# Altium project PROC154E3_SCH.PrjPcb (part 29 of 60)

## Sheet 31. USB HUB.SchDoc: USB3.0 HUB
size 513 x 386 mm; Project: PROC154E2(001)_SK_AM69; Issue: 1.0; RevCode: E3; Page Create Date: March  8, 1995; Variant Name: Core Design; Schematic Page Number: 31; Page Number: 31; Page Size: C; Comment: MISTRAL_TITLEBLK_CSIZE_1; Page Count: 62; Schematic Page Count: 62; Name: PROC154E2 001 SK AM69; DsnPath: C:\Users\danie\Downloads\sprr466c\PROC154E3_RP\PROC154E3_SCH.DSN; SchematicName: SCHEMATIC1; PageName: 31. USB HUB; PageSize: C; TopSchematic: True
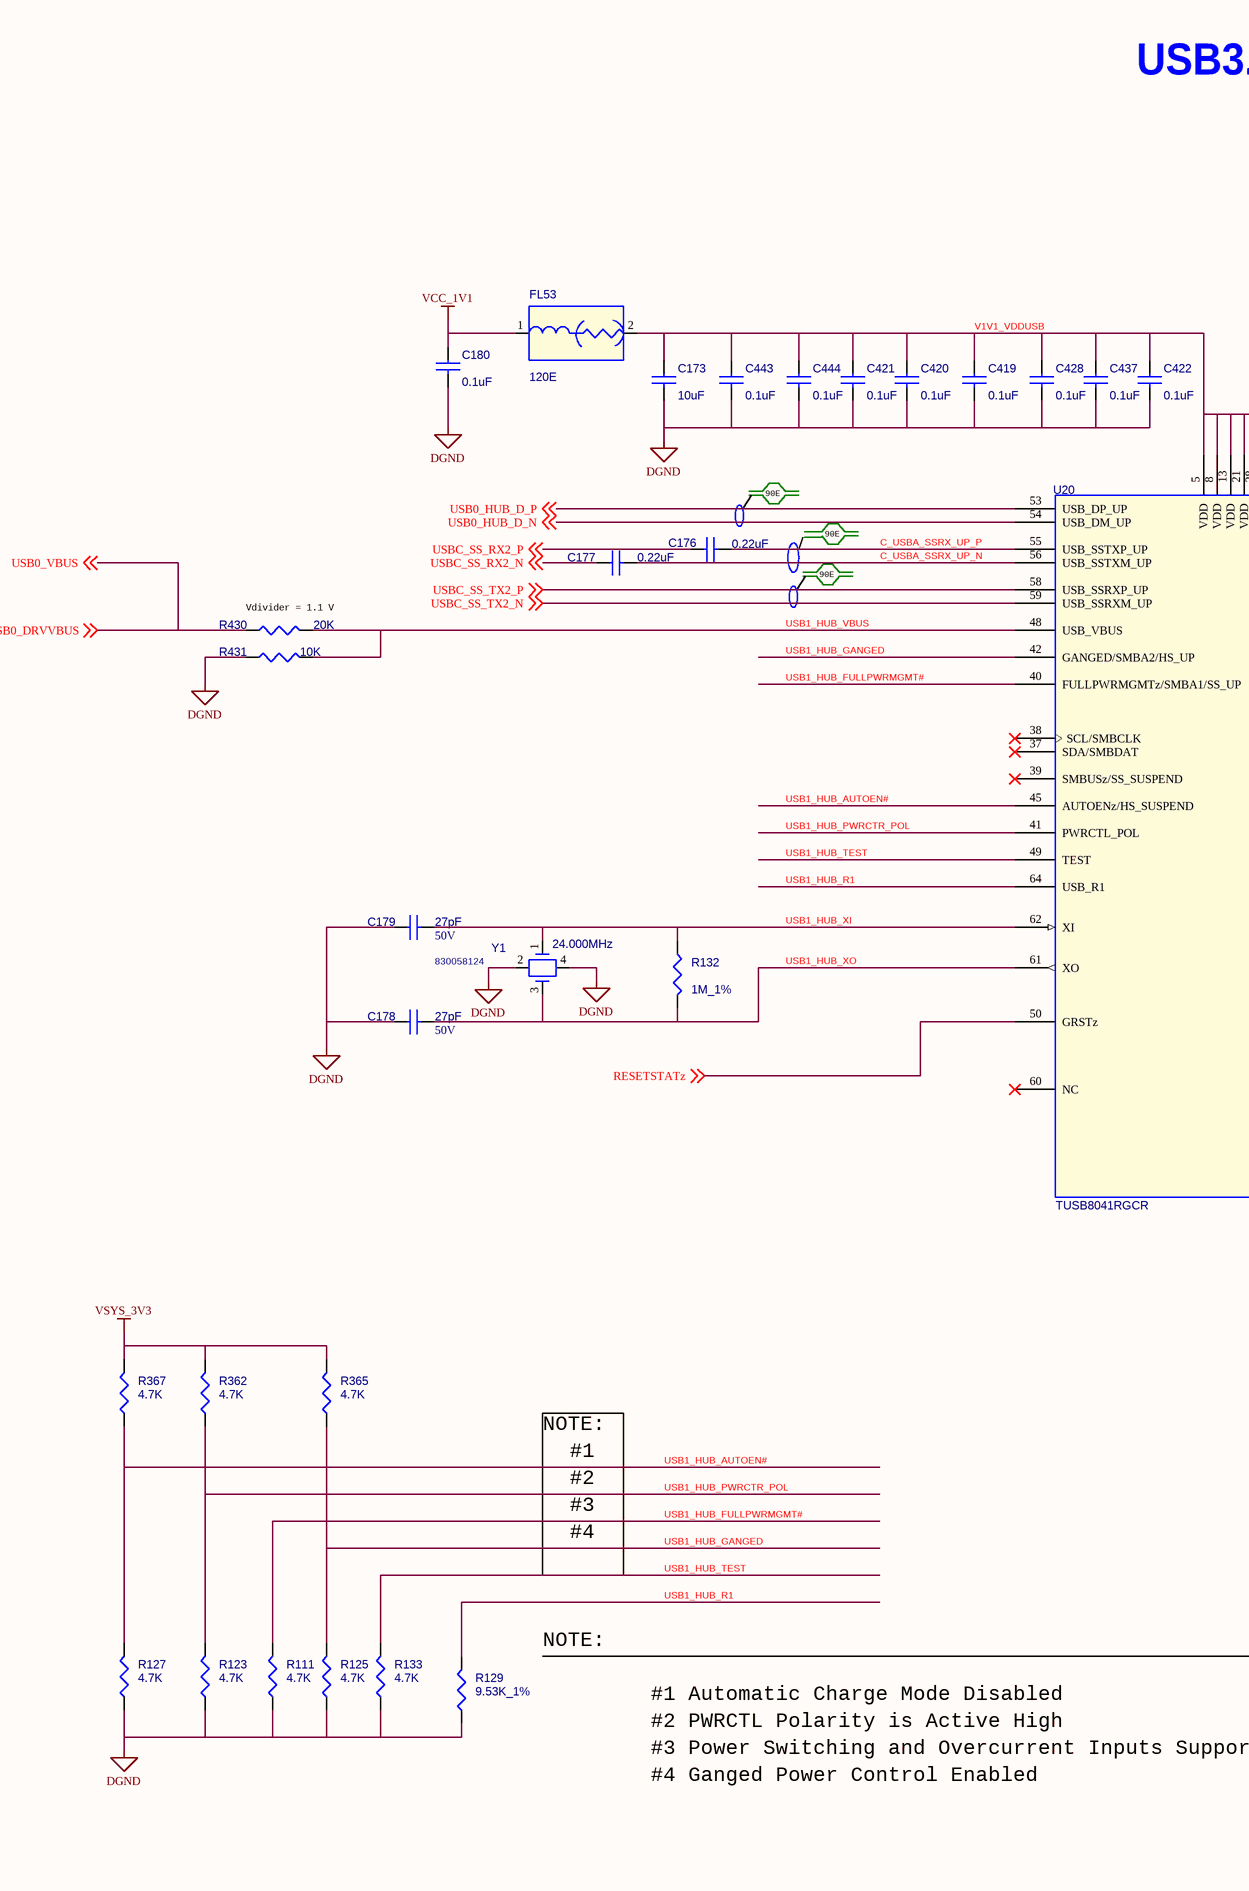
[diagram p49: 31. USB HUB.SchDoc, left]
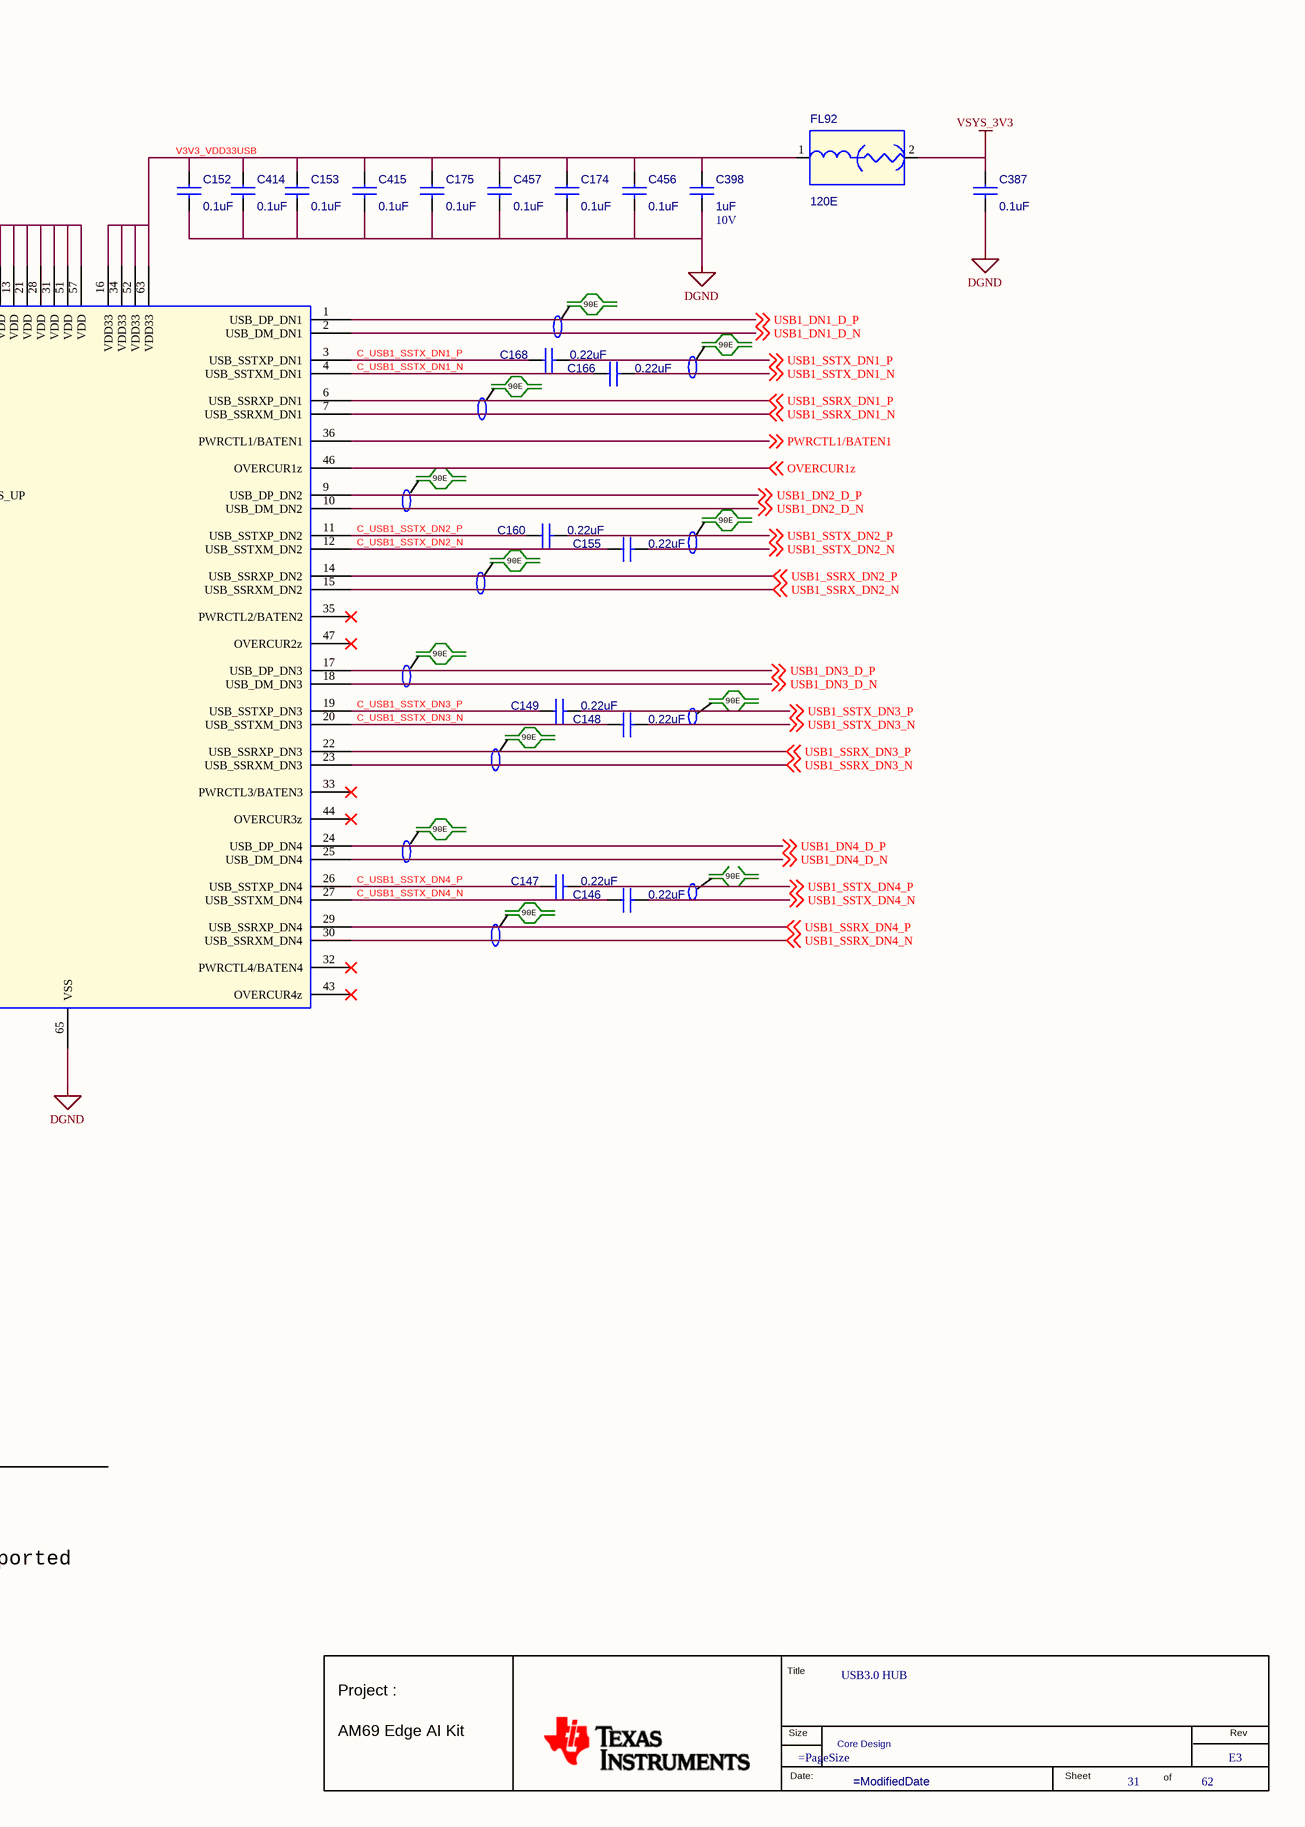
[diagram p50: 31. USB HUB.SchDoc, right]

### Parts
(Parts that share a designator on the sheet are numbered #1, #2 ... from top to bottom, then left to right.)
*#31  RevCode: E3  Title: USB3.0 HUB  Page Number: 31  Page Count: 62  Variant Name: Core Design  (hidden comment: MISTRAL_TITLEBLK_CSIZE_1)  (graphical)
C146  0.22uF  [CAP0201_0-5]
C147  0.22uF  [CAP0201_0-5]
C148  0.22uF  [CAP0201_0-5]
C149  0.22uF  [CAP0201_0-5]
C152  0.1uF  [CAP0201_0-5]
C153  0.1uF  [CAP0201_0-5]
C155  0.22uF  [CAP0201_0-5]
C160  0.22uF  [CAP0201_0-5]
C166  0.22uF  [CAP0201_0-5]
C168  0.22uF  [CAP0201_0-5]
C173  10uF  [CAP0402_1]
C174  0.1uF  [CAP0201_0-5]
C175  0.1uF  [CAP0201_0-5]
C176  0.22uF  [CAP0201_0-5]
C177  0.22uF  [CAP0201_0-5]
C178  27pF  Voltage: 50V  [CAP0402_0-75]
C179  27pF  Voltage: 50V  [CAP0402_0-75]
C180  0.1uF  [CAP0201_0-5]
C387  0.1uF  [CAP0201_0-5]
C398  1uF  Voltage: 10V  [CAP0402_0-75]
C414  0.1uF  [CAP0201_0-5]
C415  0.1uF  [CAP0201_0-5]
C419  0.1uF  [CAP0201_0-5]
C420  0.1uF  [CAP0201_0-5]
C421  0.1uF  [CAP0201_0-5]
C422  0.1uF  [CAP0201_0-5]
C428  0.1uF  [CAP0201_0-5]
C437  0.1uF  [CAP0201_0-5]
C443  0.1uF  [CAP0201_0-5]
C444  0.1uF  [CAP0201_0-5]
C456  0.1uF  [CAP0201_0-5]
C457  0.1uF  [CAP0201_0-5]
FL53  120E  [EMIFIL_BLM18P_0603_0-8]
FL92  120E  [EMIFIL_BLM18P_0603_0-8]
R111  4.7K  [RES0201_0-5]
R123  4.7K  [RES0201_0-5]
R125  4.7K  [RES0201_0-5]
R127  4.7K  [RES0201_0-5]
R129  9.53K_1%  [RES0402_0-5]
R132  1M_1%  [RES0402_0-5]
R133  4.7K  [RES0201_0-5]
R362  4.7K  [RES0201_0-5]
R365  4.7K  [RES0201_0-5]
R367  4.7K  [RES0201_0-5]
R430  20K  [RES0402_0-5]
R431  10K  [RES0402_0-5]
U20  TUSB8041RGCR  [QFN64_19-68_360X360_1_EP6-1]
Y1  24.000MHz  Mfr_part_number: 830058124  [XTAL4_LFXTAL055474_130X110_SMD_0-8]

### Nets
DGND: C152.2 C153.2 C173.2 C174.2 C175.2 C178.1 C179.1 C180.2 C387.2 C398.2 C414.2 C415.2 C419.2 C420.2 C421.2 C422.2 C428.2 C437.2 C443.2 C444.2 C456.2 C457.2 R111.1 R123.1 R125.1 R127.1 R129.1 R133.1 R431.1 U20.65(VSS) Y1.2 Y1.4  [project net VDD_CPU_HCPS_GOSNS]
VCC_1V1: C180.1 FL53.1
VSYS_3V3: C387.1 FL92.2 R362.2 R365.2 R367.2  [project net V_3V3]
C_USB1_SSTX_DN1_N: C166.1 U20.4(USB_SSTXM_DN1)
C_USB1_SSTX_DN1_P: C168.1 U20.3(USB_SSTXP_DN1)
C_USB1_SSTX_DN2_N: C155.1 U20.12(USB_SSTXM_DN2)
C_USB1_SSTX_DN2_P: C160.1 U20.11(USB_SSTXP_DN2)
C_USB1_SSTX_DN3_N: C148.1 U20.20(USB_SSTXM_DN3)
C_USB1_SSTX_DN3_P: C149.1 U20.19(USB_SSTXP_DN3)
C_USB1_SSTX_DN4_N: C146.1 U20.27(USB_SSTXM_DN4)
C_USB1_SSTX_DN4_P: C147.1 U20.26(USB_SSTXP_DN4)
C_USBA_SSRX_UP_N: C177.2 U20.56(USB_SSTXM_UP)
C_USBA_SSRX_UP_P: C176.2 U20.55(USB_SSTXP_UP)
OVERCUR1z: U20.46(OVERCUR1z) ; off-sheet OVERCUR1z
PWRCTL1/BATEN1: U20.36(PWRCTL1/BATEN1) ; off-sheet PWRCTL1/BATEN1
RESETSTATZ: U20.50(GRSTz) ; off-sheet RESETSTATz
USB0_DRVVBUS: R430.1 ; off-sheet USB0_DRVVBUS, off-sheet USB0_VBUS  [also labelled USB0_VBUS]  [project net TIMER_IO1]
USB0_HUB_D_N: U20.54(USB_DM_UP) ; off-sheet USB0_HUB_D_N
USB0_HUB_D_P: U20.53(USB_DP_UP) ; off-sheet USB0_HUB_D_P
USB1_DN1_D_N: U20.2(USB_DM_DN1) ; off-sheet USB1_DN1_D_N
USB1_DN1_D_P: U20.1(USB_DP_DN1) ; off-sheet USB1_DN1_D_P
USB1_DN2_D_N: U20.10(USB_DM_DN2) ; off-sheet USB1_DN2_D_N
USB1_DN2_D_P: U20.9(USB_DP_DN2) ; off-sheet USB1_DN2_D_P
USB1_DN3_D_N: U20.18(USB_DM_DN3) ; off-sheet USB1_DN3_D_N
USB1_DN3_D_P: U20.17(USB_DP_DN3) ; off-sheet USB1_DN3_D_P
USB1_DN4_D_N: U20.25(USB_DM_DN4) ; off-sheet USB1_DN4_D_N
USB1_DN4_D_P: U20.24(USB_DP_DN4) ; off-sheet USB1_DN4_D_P
USB1_HUB_AUTOEN#: R127.2 R367.1 U20.45(AUTOENz/HS_SUSPEND)
USB1_HUB_FULLPWRMGMT#: R111.2 U20.40(FULLPWRMGMTz/SMBA1/SS_UP)
USB1_HUB_GANGED: R125.2 R365.1 U20.42(GANGED/SMBA2/HS_UP)
USB1_HUB_PWRCTR_POL: R123.2 R362.1 U20.41(PWRCTL_POL)
USB1_HUB_R1: R129.2 U20.64(USB_R1)
USB1_HUB_TEST: R133.2 U20.49(TEST)
USB1_HUB_VBUS: R430.2 R431.2 U20.48(USB_VBUS)
USB1_HUB_XI: C179.2 R132.1 U20.62(XI) Y1.1
USB1_HUB_XO: C178.2 R132.2 U20.61(XO) Y1.3
USB1_SSRX_DN1_N: U20.7(USB_SSRXM_DN1) ; off-sheet USB1_SSRX_DN1_N
USB1_SSRX_DN1_P: U20.6(USB_SSRXP_DN1) ; off-sheet USB1_SSRX_DN1_P
USB1_SSRX_DN2_N: U20.15(USB_SSRXM_DN2) ; off-sheet USB1_SSRX_DN2_N
USB1_SSRX_DN2_P: U20.14(USB_SSRXP_DN2) ; off-sheet USB1_SSRX_DN2_P
USB1_SSRX_DN3_N: U20.23(USB_SSRXM_DN3) ; off-sheet USB1_SSRX_DN3_N
USB1_SSRX_DN3_P: U20.22(USB_SSRXP_DN3) ; off-sheet USB1_SSRX_DN3_P
USB1_SSRX_DN4_N: U20.30(USB_SSRXM_DN4) ; off-sheet USB1_SSRX_DN4_N
USB1_SSRX_DN4_P: U20.29(USB_SSRXP_DN4) ; off-sheet USB1_SSRX_DN4_P
USB1_SSTX_DN1_N: C166.2 ; off-sheet USB1_SSTX_DN1_N
USB1_SSTX_DN1_P: C168.2 ; off-sheet USB1_SSTX_DN1_P
USB1_SSTX_DN2_N: C155.2 ; off-sheet USB1_SSTX_DN2_N
USB1_SSTX_DN2_P: C160.2 ; off-sheet USB1_SSTX_DN2_P
USB1_SSTX_DN3_N: C148.2 ; off-sheet USB1_SSTX_DN3_N
USB1_SSTX_DN3_P: C149.2 ; off-sheet USB1_SSTX_DN3_P
USB1_SSTX_DN4_N: C146.2 ; off-sheet USB1_SSTX_DN4_N
USB1_SSTX_DN4_P: C147.2 ; off-sheet USB1_SSTX_DN4_P
USBC_SS_RX2_N: C177.1 ; off-sheet USBC_SS_RX2_N  [project net SERDES0_RX3_N]
USBC_SS_RX2_P: C176.1 ; off-sheet USBC_SS_RX2_P  [project net SERDES0_RX3_P]
USBC_SS_TX2_N: U20.59(USB_SSRXM_UP) ; off-sheet USBC_SS_TX2_N
USBC_SS_TX2_P: U20.58(USB_SSRXP_UP) ; off-sheet USBC_SS_TX2_P
V1V1_VDDUSB: C173.1 C419.1 C420.1 C421.1 C422.1 C428.1 C437.1 C443.1 C444.1 FL53.2 U20.5(VDD) U20.8(VDD) U20.13(VDD) U20.21(VDD) U20.28(VDD) U20.31(VDD) U20.51(VDD) U20.57(VDD)
V3V3_VDD33USB: C152.1 C153.1 C174.1 C175.1 C398.1 C414.1 C415.1 C456.1 C457.1 FL92.1 U20.16(VDD33) U20.34(VDD33) U20.52(VDD33) U20.63(VDD33)

Not connected (* = marked no-connect by the designer): U20 32(PWRCTL4/BATEN4)* 33(PWRCTL3/BATEN3)* 35(PWRCTL2/BATEN2)* 37(SDA/SMBDAT)* 38(SCL/SMBCLK)* 39(SMBUSz/SS_SUSPEND)* 43(OVERCUR4z)* 44(OVERCUR3z)* 47(OVERCUR2z)* 60(NC)*

### Notes on the sheet
- USB3.0 HUB
- 90E
- (near C168) 90E
- (near R430) Vdivider = 1.1 V
- (near C160) 90E
- (near C149) 90E
- (near C147) 90E
- NOTE:
- #1
- #2
- #3
- #4
- #1 Automatic Charge Mode Disabled
- #2 PWRCTL Polarity is Active High
- #3 Power Switching and Overcurrent Inputs Supported
- #4 Ganged Power Control Enabled
- (in symbol MISTRAL_TITLEBLK_CSIZE_1) Title; Project :; Size; Rev; AM69 Edge AI Kit; Date:; Sheet; of

### Library data of the parts
*#31 = MISTRAL_TITLEBLK_CSIZE_1: Issue: 1.0; Project: PROC154E2(001)_SK_AM69; Name: PROC154E2 001 SK AM69; Page Create Date: March  8, 1995; Page Size: =PageSize; Page Modify Date: =ModifiedDate; Schematic Page Count: 62; Schematic Page Number: 31
C146 = CAP_Dup1: CAP CERAMIC 0.22uF 6.3V 10% X6S AUTO 0201; Part Reference: C146; Part_type: CAPACITORS\CERAMIC; Mfr_part_number: GRT033C80J224KE01D; Mfr_name: MURATA; Mistral Part No: 120019020011-R; Custom_Duty: 15%; Customs_HS_Code: 85322990; Wattage: NA; Project: TI_J7ES_EVM_SOM; SIGNAL_MODEL: CAP_CAP0201_0-5_0.22UF_0.22uF; Value: 0.22uF; PCB Footprint: CAP0201_0-5; Footprint Path: Y:\MIS_DATABASE\Library\ALTIUM_TOOL\PCB_FOOTPRINTS\Altium_Footprint_Lib.PcbLib; Library Path: Y:\MIS_DATABASE\Library\ALTIUM_TOOL\SCHEMATICS_PARTS\MS_DISCRETE_Library.schlib; MECHANICAL 3D STEP FILE: CAP0201_0-5; Chkd/date: MANIRAJA/220219; Crtd /date: ALVY/220219; Datasheet: Y:\MIS_DATABASE\DATASHEETS\CAPACITORS\MURATA-GCM-SER.PDF; Temperature: -55°C+105°C; Weight: 0.17mg; Height: 0.33MM; Library Ref: CAP; Distributor_part_number: 490-12230-1-ND; Distributor_name: DIGIKEY; Package: 0201; Voltage: 6.3V; Tolerance: 10%; Footprint Ref: CAP0201_0-5
C147 = CAP_Dup1: CAP CERAMIC 0.22uF 6.3V 10% X6S AUTO 0201; Part Reference: C147; Mistral Part No: 120019020011-R; Mfr_name: MURATA; Mfr_part_number: GRT033C80J224KE01D; Part_type: CAPACITORS\CERAMIC; Project: TI_J7ES_EVM_SOM; Wattage: NA; Customs_HS_Code: 85322990; Custom_Duty: 15%; SIGNAL_MODEL: CAP_CAP0201_0-5_0.22UF_0.22uF; Value: 0.22uF; PCB Footprint: CAP0201_0-5; Footprint Ref: CAP0201_0-5; Tolerance: 10%; Voltage: 6.3V; Package: 0201; Distributor_name: DIGIKEY; Distributor_part_number: 490-12230-1-ND; Library Ref: CAP; Height: 0.33MM; Weight: 0.17mg; Temperature: -55°C+105°C; Datasheet: Y:\MIS_DATABASE\DATASHEETS\CAPACITORS\MURATA-GCM-SER.PDF; Crtd /date: ALVY/220219; Chkd/date: MANIRAJA/220219; MECHANICAL 3D STEP FILE: CAP0201_0-5; Library Path: Y:\MIS_DATABASE\Library\ALTIUM_TOOL\SCHEMATICS_PARTS\MS_DISCRETE_Library.schlib; Footprint Path: Y:\MIS_DATABASE\Library\ALTIUM_TOOL\PCB_FOOTPRINTS\Altium_Footprint_Lib.PcbLib
C148 = CAP_Dup1: CAP CERAMIC 0.22uF 6.3V 10% X6S AUTO 0201; Part Reference: C148; Mistral Part No: 120019020011-R; Mfr_name: MURATA; Mfr_part_number: GRT033C80J224KE01D; Part_type: CAPACITORS\CERAMIC; Project: TI_J7ES_EVM_SOM; Wattage: NA; Customs_HS_Code: 85322990; Custom_Duty: 15%; SIGNAL_MODEL: CAP_CAP0201_0-5_0.22UF_0.22uF; Value: 0.22uF; PCB Footprint: CAP0201_0-5; Footprint Ref: CAP0201_0-5; Tolerance: 10%; Voltage: 6.3V; Package: 0201; Distributor_name: DIGIKEY; Distributor_part_number: 490-12230-1-ND; Library Ref: CAP; Height: 0.33MM; Weight: 0.17mg; Temperature: -55°C+105°C; Datasheet: Y:\MIS_DATABASE\DATASHEETS\CAPACITORS\MURATA-GCM-SER.PDF; Crtd /date: ALVY/220219; Chkd/date: MANIRAJA/220219; MECHANICAL 3D STEP FILE: CAP0201_0-5; Library Path: Y:\MIS_DATABASE\Library\ALTIUM_TOOL\SCHEMATICS_PARTS\MS_DISCRETE_Library.schlib; Footprint Path: Y:\MIS_DATABASE\Library\ALTIUM_TOOL\PCB_FOOTPRINTS\Altium_Footprint_Lib.PcbLib
C149 = CAP_Dup1: CAP CERAMIC 0.22uF 6.3V 10% X6S AUTO 0201; Part Reference: C149; Part_type: CAPACITORS\CERAMIC; Mfr_part_number: GRT033C80J224KE01D; Mfr_name: MURATA; Mistral Part No: 120019020011-R; Custom_Duty: 15%; Customs_HS_Code: 85322990; Wattage: NA; Project: TI_J7ES_EVM_SOM; SIGNAL_MODEL: CAP_CAP0201_0-5_0.22UF_0.22uF; Value: 0.22uF; PCB Footprint: CAP0201_0-5; Footprint Path: Y:\MIS_DATABASE\Library\ALTIUM_TOOL\PCB_FOOTPRINTS\Altium_Footprint_Lib.PcbLib; Library Path: Y:\MIS_DATABASE\Library\ALTIUM_TOOL\SCHEMATICS_PARTS\MS_DISCRETE_Library.schlib; MECHANICAL 3D STEP FILE: CAP0201_0-5; Chkd/date: MANIRAJA/220219; Crtd /date: ALVY/220219; Datasheet: Y:\MIS_DATABASE\DATASHEETS\CAPACITORS\MURATA-GCM-SER.PDF; Temperature: -55°C+105°C; Weight: 0.17mg; Height: 0.33MM; Library Ref: CAP; Distributor_part_number: 490-12230-1-ND; Distributor_name: DIGIKEY; Package: 0201; Voltage: 6.3V; Tolerance: 10%; Footprint Ref: CAP0201_0-5
C152 = CAP_Dup1: CAP CERAMIC 0.1uF 16V 10% X7S AUTO 0201; Part Reference: C152; Mistral Part No: 120021030007-R; Mfr_name: MURATA; Mfr_part_number: GRT033C71C104KE01D; Part_type: CAPACITORS\CERAMIC; Project: J7ES_SK_BRD; Wattage: NA; Customs_HS_Code: 85322990; Custom_Duty: 15%; Value: 0.1uF; PCB Footprint: CAP0201_0-5; Tolerance: 10%; Voltage: 16V; Package: 0201; Distributor_name: DIGIKEY; Distributor_part_number: 490-GRT033C71C104KE01DTR-ND; Height: 0.33MM; Weight: 330mg; Temperature: -55°C+125°C; Datasheet: Y:\MIS_DATABASE\DATASHEETS\CAPACITORS\GRT033C71C104KE01.PDF; Crtd /date: ALVY/110321; Chkd/date: MANIRAJA/110321; MECHANICAL 3D STEP FILE: CAP0201_0-5
C153 = CAP_Dup1: CAP CERAMIC 0.1uF 16V 10% X7S AUTO 0201; Part Reference: C153; Mistral Part No: 120021030007-R; Mfr_name: MURATA; Mfr_part_number: GRT033C71C104KE01D; Part_type: CAPACITORS\CERAMIC; Project: J7ES_SK_BRD; Wattage: NA; Customs_HS_Code: 85322990; Custom_Duty: 15%; Value: 0.1uF; PCB Footprint: CAP0201_0-5; Tolerance: 10%; Voltage: 16V; Package: 0201; Distributor_name: DIGIKEY; Distributor_part_number: 490-GRT033C71C104KE01DTR-ND; Height: 0.33MM; Weight: 330mg; Temperature: -55°C+125°C; Datasheet: Y:\MIS_DATABASE\DATASHEETS\CAPACITORS\GRT033C71C104KE01.PDF; Crtd /date: ALVY/110321; Chkd/date: MANIRAJA/110321; MECHANICAL 3D STEP FILE: CAP0201_0-5
C155 = CAP_Dup1: CAP CERAMIC 0.22uF 6.3V 10% X6S AUTO 0201; Part Reference: C155; Mistral Part No: 120019020011-R; Mfr_name: MURATA; Mfr_part_number: GRT033C80J224KE01D; Part_type: CAPACITORS\CERAMIC; Project: TI_J7ES_EVM_SOM; Wattage: NA; Customs_HS_Code: 85322990; Custom_Duty: 15%; SIGNAL_MODEL: CAP_CAP0201_0-5_0.22UF_0.22uF; Value: 0.22uF; PCB Footprint: CAP0201_0-5; Footprint Ref: CAP0201_0-5; Tolerance: 10%; Voltage: 6.3V; Package: 0201; Distributor_name: DIGIKEY; Distributor_part_number: 490-12230-1-ND; Library Ref: CAP; Height: 0.33MM; Weight: 0.17mg; Temperature: -55°C+105°C; Datasheet: Y:\MIS_DATABASE\DATASHEETS\CAPACITORS\MURATA-GCM-SER.PDF; Crtd /date: ALVY/220219; Chkd/date: MANIRAJA/220219; MECHANICAL 3D STEP FILE: CAP0201_0-5; Library Path: Y:\MIS_DATABASE\Library\ALTIUM_TOOL\SCHEMATICS_PARTS\MS_DISCRETE_Library.schlib; Footprint Path: Y:\MIS_DATABASE\Library\ALTIUM_TOOL\PCB_FOOTPRINTS\Altium_Footprint_Lib.PcbLib
C160 = CAP_Dup1: CAP CERAMIC 0.22uF 6.3V 10% X6S AUTO 0201; Part Reference: C160; Mistral Part No: 120019020011-R; Mfr_name: MURATA; Mfr_part_number: GRT033C80J224KE01D; Part_type: CAPACITORS\CERAMIC; Project: TI_J7ES_EVM_SOM; Wattage: NA; Customs_HS_Code: 85322990; Custom_Duty: 15%; SIGNAL_MODEL: CAP_CAP0201_0-5_0.22UF_0.22uF; Value: 0.22uF; PCB Footprint: CAP0201_0-5; Footprint Ref: CAP0201_0-5; Tolerance: 10%; Voltage: 6.3V; Package: 0201; Distributor_name: DIGIKEY; Distributor_part_number: 490-12230-1-ND; Library Ref: CAP; Height: 0.33MM; Weight: 0.17mg; Temperature: -55°C+105°C; Datasheet: Y:\MIS_DATABASE\DATASHEETS\CAPACITORS\MURATA-GCM-SER.PDF; Crtd /date: ALVY/220219; Chkd/date: MANIRAJA/220219; MECHANICAL 3D STEP FILE: CAP0201_0-5; Library Path: Y:\MIS_DATABASE\Library\ALTIUM_TOOL\SCHEMATICS_PARTS\MS_DISCRETE_Library.schlib; Footprint Path: Y:\MIS_DATABASE\Library\ALTIUM_TOOL\PCB_FOOTPRINTS\Altium_Footprint_Lib.PcbLib
C166 = CAP_Dup1: CAP CERAMIC 0.22uF 6.3V 10% X6S AUTO 0201; Part Reference: C166; Part_type: CAPACITORS\CERAMIC; Mfr_part_number: GRT033C80J224KE01D; Mfr_name: MURATA; Mistral Part No: 120019020011-R; Custom_Duty: 15%; Customs_HS_Code: 85322990; Wattage: NA; Project: TI_J7ES_EVM_SOM; SIGNAL_MODEL: CAP_CAP0201_0-5_0.22UF_0.22uF; Value: 0.22uF; PCB Footprint: CAP0201_0-5; Footprint Path: Y:\MIS_DATABASE\Library\ALTIUM_TOOL\PCB_FOOTPRINTS\Altium_Footprint_Lib.PcbLib; Library Path: Y:\MIS_DATABASE\Library\ALTIUM_TOOL\SCHEMATICS_PARTS\MS_DISCRETE_Library.schlib; MECHANICAL 3D STEP FILE: CAP0201_0-5; Chkd/date: MANIRAJA/220219; Crtd /date: ALVY/220219; Datasheet: Y:\MIS_DATABASE\DATASHEETS\CAPACITORS\MURATA-GCM-SER.PDF; Temperature: -55°C+105°C; Weight: 0.17mg; Height: 0.33MM; Library Ref: CAP; Distributor_part_number: 490-12230-1-ND; Distributor_name: DIGIKEY; Package: 0201; Voltage: 6.3V; Tolerance: 10%; Footprint Ref: CAP0201_0-5
C168 = CAP_Dup1: CAP CERAMIC 0.22uF 6.3V 10% X6S AUTO 0201; Part Reference: C168; Part_type: CAPACITORS\CERAMIC; Mfr_part_number: GRT033C80J224KE01D; Mfr_name: MURATA; Mistral Part No: 120019020011-R; Custom_Duty: 15%; Customs_HS_Code: 85322990; Wattage: NA; Project: TI_J7ES_EVM_SOM; SIGNAL_MODEL: CAP_CAP0201_0-5_0.22UF_0.22uF; Value: 0.22uF; PCB Footprint: CAP0201_0-5; Footprint Path: Y:\MIS_DATABASE\Library\ALTIUM_TOOL\PCB_FOOTPRINTS\Altium_Footprint_Lib.PcbLib; Library Path: Y:\MIS_DATABASE\Library\ALTIUM_TOOL\SCHEMATICS_PARTS\MS_DISCRETE_Library.schlib; MECHANICAL 3D STEP FILE: CAP0201_0-5; Chkd/date: MANIRAJA/220219; Crtd /date: ALVY/220219; Datasheet: Y:\MIS_DATABASE\DATASHEETS\CAPACITORS\MURATA-GCM-SER.PDF; Temperature: -55°C+105°C; Weight: 0.17mg; Height: 0.33MM; Library Ref: CAP; Distributor_part_number: 490-12230-1-ND; Distributor_name: DIGIKEY; Package: 0201; Voltage: 6.3V; Tolerance: 10%; Footprint Ref: CAP0201_0-5
C173 = CAP_Dup1: CAP CERAMIC 10uF 10V 20% X5R 0402; Part Reference: C173; Mistral Part No: 120019020008-R; Mfr_name: SAMSUNG; Mfr_part_number: CL05A106MP8NUB8; Part_type: CAPACITORS\CERAMIC; Project: TI_60GHz-AOP; Wattage: NA; Customs_HS_Code: 85322990; Custom_Duty: 15%; Value: 10uF; PCB Footprint: CAP0402_1; Footprint Ref: CAP0402_1; Tolerance: 20%; Voltage: 10V; Package: 0402; Distributor_name: DIGIKEY; Distributor_part_number: 1276-6830-1-ND; Library Ref: CAP; Height: 0.90MM; Weight: NA; Temperature: -55°C+85°C; Datasheet: Y:\MIS_DATABASE\DATASHEETS\CAPACITORS\CL05A106MP8NUB8.PDF; Crtd /date: ALVY/150219; Chkd/date: MANIRAJA/150219; MECHANICAL 3D STEP FILE: CAP0402_1; Library Path: Y:\MIS_DATABASE\Library\ALTIUM_TOOL\SCHEMATICS_PARTS\MS_DISCRETE_Library.schlib; Footprint Path: Y:\MIS_DATABASE\Library\ALTIUM_TOOL\PCB_FOOTPRINTS\Altium_Footprint_Lib.PcbLib
C174 = CAP_Dup1: CAP CERAMIC 0.1uF 16V 10% X7S AUTO 0201; Part Reference: C174; Mistral Part No: 120021030007-R; Mfr_name: MURATA; Mfr_part_number: GRT033C71C104KE01D; Part_type: CAPACITORS\CERAMIC; Project: J7ES_SK_BRD; Wattage: NA; Customs_HS_Code: 85322990; Custom_Duty: 15%; Value: 0.1uF; PCB Footprint: CAP0201_0-5; Tolerance: 10%; Voltage: 16V; Package: 0201; Distributor_name: DIGIKEY; Distributor_part_number: 490-GRT033C71C104KE01DTR-ND; Height: 0.33MM; Weight: 330mg; Temperature: -55°C+125°C; Datasheet: Y:\MIS_DATABASE\DATASHEETS\CAPACITORS\GRT033C71C104KE01.PDF; Crtd /date: ALVY/110321; Chkd/date: MANIRAJA/110321; MECHANICAL 3D STEP FILE: CAP0201_0-5
C175 = CAP_Dup1: CAP CERAMIC 0.1uF 16V 10% X7S AUTO 0201; Part Reference: C175; Mistral Part No: 120021030007-R; Mfr_name: MURATA; Mfr_part_number: GRT033C71C104KE01D; Part_type: CAPACITORS\CERAMIC; Project: J7ES_SK_BRD; Wattage: NA; Customs_HS_Code: 85322990; Custom_Duty: 15%; Value: 0.1uF; PCB Footprint: CAP0201_0-5; Tolerance: 10%; Voltage: 16V; Package: 0201; Distributor_name: DIGIKEY; Distributor_part_number: 490-GRT033C71C104KE01DTR-ND; Height: 0.33MM; Weight: 330mg; Temperature: -55°C+125°C; Datasheet: Y:\MIS_DATABASE\DATASHEETS\CAPACITORS\GRT033C71C104KE01.PDF; Crtd /date: ALVY/110321; Chkd/date: MANIRAJA/110321; MECHANICAL 3D STEP FILE: CAP0201_0-5
C176 = CAP_Dup1: CAP CERAMIC 0.22uF 6.3V 10% X6S AUTO 0201; Part Reference: C176; Part_type: CAPACITORS\CERAMIC; Mfr_part_number: GRT033C80J224KE01D; Mfr_name: MURATA; Mistral Part No: 120019020011-R; Custom_Duty: 15%; Customs_HS_Code: 85322990; Wattage: NA; Project: TI_J7ES_EVM_SOM; SIGNAL_MODEL: CAP_CAP0201_0-5_0.22UF_0.22uF; Value: 0.22uF; PCB Footprint: CAP0201_0-5; Footprint Path: Y:\MIS_DATABASE\Library\ALTIUM_TOOL\PCB_FOOTPRINTS\Altium_Footprint_Lib.PcbLib; Library Path: Y:\MIS_DATABASE\Library\ALTIUM_TOOL\SCHEMATICS_PARTS\MS_DISCRETE_Library.schlib; MECHANICAL 3D STEP FILE: CAP0201_0-5; Chkd/date: MANIRAJA/220219; Crtd /date: ALVY/220219; Datasheet: Y:\MIS_DATABASE\DATASHEETS\CAPACITORS\MURATA-GCM-SER.PDF; Temperature: -55°C+105°C; Weight: 0.17mg; Height: 0.33MM; Library Ref: CAP; Distributor_part_number: 490-12230-1-ND; Distributor_name: DIGIKEY; Package: 0201; Voltage: 6.3V; Tolerance: 10%; Footprint Ref: CAP0201_0-5
C177 = CAP_Dup1: CAP CERAMIC 0.22uF 6.3V 10% X6S AUTO 0201; Part Reference: C177; Mistral Part No: 120019020011-R; Mfr_name: MURATA; Mfr_part_number: GRT033C80J224KE01D; Part_type: CAPACITORS\CERAMIC; Project: TI_J7ES_EVM_SOM; Wattage: NA; Customs_HS_Code: 85322990; Custom_Duty: 15%; SIGNAL_MODEL: CAP_CAP0201_0-5_0.22UF_0.22uF; Value: 0.22uF; PCB Footprint: CAP0201_0-5; Footprint Ref: CAP0201_0-5; Tolerance: 10%; Voltage: 6.3V; Package: 0201; Distributor_name: DIGIKEY; Distributor_part_number: 490-12230-1-ND; Library Ref: CAP; Height: 0.33MM; Weight: 0.17mg; Temperature: -55°C+105°C; Datasheet: Y:\MIS_DATABASE\DATASHEETS\CAPACITORS\MURATA-GCM-SER.PDF; Crtd /date: ALVY/220219; Chkd/date: MANIRAJA/220219; MECHANICAL 3D STEP FILE: CAP0201_0-5; Library Path: Y:\MIS_DATABASE\Library\ALTIUM_TOOL\SCHEMATICS_PARTS\MS_DISCRETE_Library.schlib; Footprint Path: Y:\MIS_DATABASE\Library\ALTIUM_TOOL\PCB_FOOTPRINTS\Altium_Footprint_Lib.PcbLib
C178 = CAP_Dup1: CAP CERAMIC 27pF 50V 5% C0G(NP0) AUTO 0402; Part Reference: C178; Automotive Alternate_mfr_part_number: CGA2B2C0G1H270J050BA; Automotive Alternate_mfr_name: TDK; Direct Alternate_mfr_part_number: CL05C270JB5NNNC; Direct Alternate_mfr_name: SAMSUNG; Mistral Part No: 120019040040-R; Mfr_name: MURATA; Mfr_part_number: GCM1555C1H270JA16D; Part_type: CAPACITORS\CERAMIC; Wattage: NA; Project: RSAPR_TYPE-II_DIO; Customs_HS_Code: 85322990; Custom_Duty: 15%; Value: 27pF; PCB Footprint: CAP0402_0-75; Footprint Path: Y:\MIS_DATABASE\Library\ALTIUM_TOOL\PCB_FOOTPRINTS\Altium_Footprint_Lib.PcbLib; Library Path: Y:\MIS_DATABASE\Library\ALTIUM_TOOL\SCHEMATICS_PARTS\MS_DISCRETE_Library.schlib; MECHANICAL 3D STEP FILE: CAP0402_0-75; Temperature: -55°C+125°C; Weight: 6mg; Footprint Ref: CAP0402_0-75; Tolerance: 5%; Package: 0402; Distributor_name: DIGIKEY; Distributor_part_number: 490-12651-1-ND; Library Ref: CAP; Height: 0.55MM; Datasheet: Y:\MIS_DATABASE\DATASHEETS\CAPACITORS\MURATA-GCM-SER.PDF; Crtd /date: ALVY/260218; Chkd/date: MANIRAJA/270218
C179 = CAP_Dup1: CAP CERAMIC 27pF 50V 5% C0G(NP0) AUTO 0402; Part Reference: C179; Automotive Alternate_mfr_part_number: CGA2B2C0G1H270J050BA; Automotive Alternate_mfr_name: TDK; Direct Alternate_mfr_part_number: CL05C270JB5NNNC; Direct Alternate_mfr_name: SAMSUNG; Mistral Part No: 120019040040-R; Mfr_name: MURATA; Mfr_part_number: GCM1555C1H270JA16D; Part_type: CAPACITORS\CERAMIC; Wattage: NA; Project: RSAPR_TYPE-II_DIO; Customs_HS_Code: 85322990; Custom_Duty: 15%; Value: 27pF; PCB Footprint: CAP0402_0-75; Footprint Path: Y:\MIS_DATABASE\Library\ALTIUM_TOOL\PCB_FOOTPRINTS\Altium_Footprint_Lib.PcbLib; Library Path: Y:\MIS_DATABASE\Library\ALTIUM_TOOL\SCHEMATICS_PARTS\MS_DISCRETE_Library.schlib; MECHANICAL 3D STEP FILE: CAP0402_0-75; Temperature: -55°C+125°C; Weight: 6mg; Footprint Ref: CAP0402_0-75; Tolerance: 5%; Package: 0402; Distributor_name: DIGIKEY; Distributor_part_number: 490-12651-1-ND; Library Ref: CAP; Height: 0.55MM; Datasheet: Y:\MIS_DATABASE\DATASHEETS\CAPACITORS\MURATA-GCM-SER.PDF; Crtd /date: ALVY/260218; Chkd/date: MANIRAJA/270218
C180 = CAP_Dup1: CAP CERAMIC 0.1uF 16V 10% X7S AUTO 0201; Part Reference: C180; Mistral Part No: 120021030007-R; Mfr_name: MURATA; Mfr_part_number: GRT033C71C104KE01D; Part_type: CAPACITORS\CERAMIC; Project: J7ES_SK_BRD; Wattage: NA; Customs_HS_Code: 85322990; Custom_Duty: 15%; Value: 0.1uF; PCB Footprint: CAP0201_0-5; Tolerance: 10%; Voltage: 16V; Package: 0201; Distributor_name: DIGIKEY; Distributor_part_number: 490-GRT033C71C104KE01DTR-ND; Height: 0.33MM; Weight: 330mg; Temperature: -55°C+125°C; Datasheet: Y:\MIS_DATABASE\DATASHEETS\CAPACITORS\GRT033C71C104KE01.PDF; Crtd /date: ALVY/110321; Chkd/date: MANIRAJA/110321; MECHANICAL 3D STEP FILE: CAP0201_0-5
C387 = CAP_Dup1: CAP CERAMIC 0.1uF 16V 10% X7S AUTO 0201; Part Reference: C387; Mistral Part No: 120021030007-R; Mfr_name: MURATA; Mfr_part_number: GRT033C71C104KE01D; Part_type: CAPACITORS\CERAMIC; Project: J7ES_SK_BRD; Wattage: NA; Customs_HS_Code: 85322990; Custom_Duty: 15%; Value: 0.1uF; PCB Footprint: CAP0201_0-5; Tolerance: 10%; Voltage: 16V; Package: 0201; Distributor_name: DIGIKEY; Distributor_part_number: 490-GRT033C71C104KE01DTR-ND; Height: 0.33MM; Weight: 330mg; Temperature: -55°C+125°C; Datasheet: Y:\MIS_DATABASE\DATASHEETS\CAPACITORS\GRT033C71C104KE01.PDF; Crtd /date: ALVY/110321; Chkd/date: MANIRAJA/110321; MECHANICAL 3D STEP FILE: CAP0201_0-5
C398 = CAP_Dup1: CAP CERAMIC 1uF 10V 10% X7S AUTO 0402; Part Reference: C398; Mistral Part No: 120018090021-R; Mfr_name: MURATA; Mfr_part_number: GCM155C71A105KE38D; Part_type: CAPACITORS\CERAMIC; Project: SMART-M_SCRIPTALK_PB; Wattage: NA; Customs_HS_Code: 85322990; Custom_Duty: 15%; Value: 1uF; PCB Footprint: CAP0402_0-75; Footprint Path: Y:\MIS_DATABASE\Library\ALTIUM_TOOL\PCB_FOOTPRINTS\Altium_Footprint_Lib.PcbLib; Library Path: Y:\MIS_DATABASE\Library\ALTIUM_TOOL\SCHEMATICS_PARTS\MS_DISCRETE_Library.schlib; Footprint Ref: CAP0402_0-75; Tolerance: 10%; Package: 0402; Distributor_name: DIGIKEY; Distributor_part_number: 490-13409-1-ND; Height: 0.70MM; Weight: 6mg; Temperature: -55°C+125°C; Datasheet: Y:\MIS_DATABASE\DATASHEETS\CAPACITORS\MURATA-GCM-SER.PDF; Crtd /date: ALVY/100918; Chkd/date: MANIRAJA/100918; Library Ref: CAP; MECHANICAL 3D STEP FILE: CAP0402_0-75
C414 = CAP_Dup1: CAP CERAMIC 0.1uF 16V 10% X7S AUTO 0201; Part Reference: C414; Mistral Part No: 120021030007-R; Mfr_name: MURATA; Mfr_part_number: GRT033C71C104KE01D; Part_type: CAPACITORS\CERAMIC; Project: J7ES_SK_BRD; Wattage: NA; Customs_HS_Code: 85322990; Custom_Duty: 15%; Value: 0.1uF; PCB Footprint: CAP0201_0-5; Tolerance: 10%; Voltage: 16V; Package: 0201; Distributor_name: DIGIKEY; Distributor_part_number: 490-GRT033C71C104KE01DTR-ND; Height: 0.33MM; Weight: 330mg; Temperature: -55°C+125°C; Datasheet: Y:\MIS_DATABASE\DATASHEETS\CAPACITORS\GRT033C71C104KE01.PDF; Crtd /date: ALVY/110321; Chkd/date: MANIRAJA/110321; MECHANICAL 3D STEP FILE: CAP0201_0-5
C415 = CAP_Dup1: CAP CERAMIC 0.1uF 16V 10% X7S AUTO 0201; Part Reference: C415; Mistral Part No: 120021030007-R; Mfr_name: MURATA; Mfr_part_number: GRT033C71C104KE01D; Part_type: CAPACITORS\CERAMIC; Project: J7ES_SK_BRD; Wattage: NA; Customs_HS_Code: 85322990; Custom_Duty: 15%; Value: 0.1uF; PCB Footprint: CAP0201_0-5; Tolerance: 10%; Voltage: 16V; Package: 0201; Distributor_name: DIGIKEY; Distributor_part_number: 490-GRT033C71C104KE01DTR-ND; Height: 0.33MM; Weight: 330mg; Temperature: -55°C+125°C; Datasheet: Y:\MIS_DATABASE\DATASHEETS\CAPACITORS\GRT033C71C104KE01.PDF; Crtd /date: ALVY/110321; Chkd/date: MANIRAJA/110321; MECHANICAL 3D STEP FILE: CAP0201_0-5
C419 = CAP_Dup1: CAP CERAMIC 0.1uF 16V 10% X7S AUTO 0201; Part Reference: C419; Mistral Part No: 120021030007-R; Mfr_name: MURATA; Mfr_part_number: GRT033C71C104KE01D; Part_type: CAPACITORS\CERAMIC; Project: J7ES_SK_BRD; Wattage: NA; Customs_HS_Code: 85322990; Custom_Duty: 15%; Value: 0.1uF; PCB Footprint: CAP0201_0-5; Tolerance: 10%; Voltage: 16V; Package: 0201; Distributor_name: DIGIKEY; Distributor_part_number: 490-GRT033C71C104KE01DTR-ND; Height: 0.33MM; Weight: 330mg; Temperature: -55°C+125°C; Datasheet: Y:\MIS_DATABASE\DATASHEETS\CAPACITORS\GRT033C71C104KE01.PDF; Crtd /date: ALVY/110321; Chkd/date: MANIRAJA/110321; MECHANICAL 3D STEP FILE: CAP0201_0-5
C420 = CAP_Dup1: CAP CERAMIC 0.1uF 16V 10% X7S AUTO 0201; Part Reference: C420; Mistral Part No: 120021030007-R; Mfr_name: MURATA; Mfr_part_number: GRT033C71C104KE01D; Part_type: CAPACITORS\CERAMIC; Project: J7ES_SK_BRD; Wattage: NA; Customs_HS_Code: 85322990; Custom_Duty: 15%; Value: 0.1uF; PCB Footprint: CAP0201_0-5; Tolerance: 10%; Voltage: 16V; Package: 0201; Distributor_name: DIGIKEY; Distributor_part_number: 490-GRT033C71C104KE01DTR-ND; Height: 0.33MM; Weight: 330mg; Temperature: -55°C+125°C; Datasheet: Y:\MIS_DATABASE\DATASHEETS\CAPACITORS\GRT033C71C104KE01.PDF; Crtd /date: ALVY/110321; Chkd/date: MANIRAJA/110321; MECHANICAL 3D STEP FILE: CAP0201_0-5
C421 = CAP_Dup1: CAP CERAMIC 0.1uF 16V 10% X7S AUTO 0201; Part Reference: C421; Mistral Part No: 120021030007-R; Mfr_name: MURATA; Mfr_part_number: GRT033C71C104KE01D; Part_type: CAPACITORS\CERAMIC; Project: J7ES_SK_BRD; Wattage: NA; Customs_HS_Code: 85322990; Custom_Duty: 15%; Value: 0.1uF; PCB Footprint: CAP0201_0-5; Tolerance: 10%; Voltage: 16V; Package: 0201; Distributor_name: DIGIKEY; Distributor_part_number: 490-GRT033C71C104KE01DTR-ND; Height: 0.33MM; Weight: 330mg; Temperature: -55°C+125°C; Datasheet: Y:\MIS_DATABASE\DATASHEETS\CAPACITORS\GRT033C71C104KE01.PDF; Crtd /date: ALVY/110321; Chkd/date: MANIRAJA/110321; MECHANICAL 3D STEP FILE: CAP0201_0-5
C422 = CAP_Dup1: CAP CERAMIC 0.1uF 16V 10% X7S AUTO 0201; Part Reference: C422; Mistral Part No: 120021030007-R; Mfr_name: MURATA; Mfr_part_number: GRT033C71C104KE01D; Part_type: CAPACITORS\CERAMIC; Project: J7ES_SK_BRD; Wattage: NA; Customs_HS_Code: 85322990; Custom_Duty: 15%; Value: 0.1uF; PCB Footprint: CAP0201_0-5; Tolerance: 10%; Voltage: 16V; Package: 0201; Distributor_name: DIGIKEY; Distributor_part_number: 490-GRT033C71C104KE01DTR-ND; Height: 0.33MM; Weight: 330mg; Temperature: -55°C+125°C; Datasheet: Y:\MIS_DATABASE\DATASHEETS\CAPACITORS\GRT033C71C104KE01.PDF; Crtd /date: ALVY/110321; Chkd/date: MANIRAJA/110321; MECHANICAL 3D STEP FILE: CAP0201_0-5
C428 = CAP_Dup1: CAP CERAMIC 0.1uF 16V 10% X7S AUTO 0201; Part Reference: C428; Mistral Part No: 120021030007-R; Mfr_name: MURATA; Mfr_part_number: GRT033C71C104KE01D; Part_type: CAPACITORS\CERAMIC; Project: J7ES_SK_BRD; Wattage: NA; Customs_HS_Code: 85322990; Custom_Duty: 15%; Value: 0.1uF; PCB Footprint: CAP0201_0-5; Tolerance: 10%; Voltage: 16V; Package: 0201; Distributor_name: DIGIKEY; Distributor_part_number: 490-GRT033C71C104KE01DTR-ND; Height: 0.33MM; Weight: 330mg; Temperature: -55°C+125°C; Datasheet: Y:\MIS_DATABASE\DATASHEETS\CAPACITORS\GRT033C71C104KE01.PDF; Crtd /date: ALVY/110321; Chkd/date: MANIRAJA/110321; MECHANICAL 3D STEP FILE: CAP0201_0-5
C437 = CAP_Dup1: CAP CERAMIC 0.1uF 16V 10% X7S AUTO 0201; Part Reference: C437; Mistral Part No: 120021030007-R; Mfr_name: MURATA; Mfr_part_number: GRT033C71C104KE01D; Part_type: CAPACITORS\CERAMIC; Project: J7ES_SK_BRD; Wattage: NA; Customs_HS_Code: 85322990; Custom_Duty: 15%; Value: 0.1uF; PCB Footprint: CAP0201_0-5; Tolerance: 10%; Voltage: 16V; Package: 0201; Distributor_name: DIGIKEY; Distributor_part_number: 490-GRT033C71C104KE01DTR-ND; Height: 0.33MM; Weight: 330mg; Temperature: -55°C+125°C; Datasheet: Y:\MIS_DATABASE\DATASHEETS\CAPACITORS\GRT033C71C104KE01.PDF; Crtd /date: ALVY/110321; Chkd/date: MANIRAJA/110321; MECHANICAL 3D STEP FILE: CAP0201_0-5
C443 = CAP_Dup1: CAP CERAMIC 0.1uF 16V 10% X7S AUTO 0201; Part Reference: C443; Mistral Part No: 120021030007-R; Mfr_name: MURATA; Mfr_part_number: GRT033C71C104KE01D; Part_type: CAPACITORS\CERAMIC; Project: J7ES_SK_BRD; Wattage: NA; Customs_HS_Code: 85322990; Custom_Duty: 15%; Value: 0.1uF; PCB Footprint: CAP0201_0-5; Tolerance: 10%; Voltage: 16V; Package: 0201; Distributor_name: DIGIKEY; Distributor_part_number: 490-GRT033C71C104KE01DTR-ND; Height: 0.33MM; Weight: 330mg; Temperature: -55°C+125°C; Datasheet: Y:\MIS_DATABASE\DATASHEETS\CAPACITORS\GRT033C71C104KE01.PDF; Crtd /date: ALVY/110321; Chkd/date: MANIRAJA/110321; MECHANICAL 3D STEP FILE: CAP0201_0-5
C444 = CAP_Dup1: CAP CERAMIC 0.1uF 16V 10% X7S AUTO 0201; Part Reference: C444; Mistral Part No: 120021030007-R; Mfr_name: MURATA; Mfr_part_number: GRT033C71C104KE01D; Part_type: CAPACITORS\CERAMIC; Project: J7ES_SK_BRD; Wattage: NA; Customs_HS_Code: 85322990; Custom_Duty: 15%; Value: 0.1uF; PCB Footprint: CAP0201_0-5; Tolerance: 10%; Voltage: 16V; Package: 0201; Distributor_name: DIGIKEY; Distributor_part_number: 490-GRT033C71C104KE01DTR-ND; Height: 0.33MM; Weight: 330mg; Temperature: -55°C+125°C; Datasheet: Y:\MIS_DATABASE\DATASHEETS\CAPACITORS\GRT033C71C104KE01.PDF; Crtd /date: ALVY/110321; Chkd/date: MANIRAJA/110321; MECHANICAL 3D STEP FILE: CAP0201_0-5
C456 = CAP_Dup1: CAP CERAMIC 0.1uF 16V 10% X7S AUTO 0201; Part Reference: C456; Mistral Part No: 120021030007-R; Mfr_name: MURATA; Mfr_part_number: GRT033C71C104KE01D; Part_type: CAPACITORS\CERAMIC; Project: J7ES_SK_BRD; Wattage: NA; Customs_HS_Code: 85322990; Custom_Duty: 15%; Value: 0.1uF; PCB Footprint: CAP0201_0-5; Tolerance: 10%; Voltage: 16V; Package: 0201; Distributor_name: DIGIKEY; Distributor_part_number: 490-GRT033C71C104KE01DTR-ND; Height: 0.33MM; Weight: 330mg; Temperature: -55°C+125°C; Datasheet: Y:\MIS_DATABASE\DATASHEETS\CAPACITORS\GRT033C71C104KE01.PDF; Crtd /date: ALVY/110321; Chkd/date: MANIRAJA/110321; MECHANICAL 3D STEP FILE: CAP0201_0-5
C457 = CAP_Dup1: CAP CERAMIC 0.1uF 16V 10% X7S AUTO 0201; Part Reference: C457; Mistral Part No: 120021030007-R; Mfr_name: MURATA; Mfr_part_number: GRT033C71C104KE01D; Part_type: CAPACITORS\CERAMIC; Project: J7ES_SK_BRD; Wattage: NA; Customs_HS_Code: 85322990; Custom_Duty: 15%; Value: 0.1uF; PCB Footprint: CAP0201_0-5; Tolerance: 10%; Voltage: 16V; Package: 0201; Distributor_name: DIGIKEY; Distributor_part_number: 490-GRT033C71C104KE01DTR-ND; Height: 0.33MM; Weight: 330mg; Temperature: -55°C+125°C; Datasheet: Y:\MIS_DATABASE\DATASHEETS\CAPACITORS\GRT033C71C104KE01.PDF; Crtd /date: ALVY/110321; Chkd/date: MANIRAJA/110321; MECHANICAL 3D STEP FILE: CAP0201_0-5
FL53 = EMIFILTER_IND: IND FERRITE BEAD CHIP 120E 3A 0603; Part Reference: FL53; Automotive Alternate_mfr_part_number: MPZ1608S121ATDH5; Automotive Alternate_mfr_name: TDK; Direct Alternate_mfr_part_number: MPZ1608S121ATAH0; Part_type: INDUCTOR; Mfr_part_number: BLM18KG121TH1D; Mfr_name: MURATA; Mistral Part No: 130018100051-R; Custom_Duty: 24%; Customs_HS_Code: 85437099; Wattage: NA; Tolerance: 25%; Project: TI_J7ES_EVM_SOM; Value: 120E; PCB Footprint: EMIFIL_BLM18P_0603_0-8; Direct Alternate_mfr_name: TDK; Footprint Path: Y:\MIS_DATABASE\Library\ALTIUM_TOOL\PCB_FOOTPRINTS\Altium_Footprint_Lib.PcbLib; Library Path: Y:\MIS_DATABASE\Library\ALTIUM_TOOL\SCHEMATICS_PARTS\MS_FILTER_Library.schlib; MECHANICAL 3D STEP FILE: EMIFIL_BLM18P_0603_0-8; Chkd/date: MANIRAJA/251018; Crtd /date: ALVY/251018; Datasheet: Y:\MIS_DATABASE\DATASHEETS\DISCRETES\INDUCTORS\BLM18XX-H1D-SER.PDF; Temperature: -55°C+125°C; Weight: 4mg; Height: 0.75MM; Library Ref: EMIFILTER_IND; Distributor_part_number: 490-13261-1-ND; Distributor_name: DIGIKEY; Package: 0603; Voltage: NA; Footprint Ref: EMIFIL_BLM18P_0603_0-8
FL92 = EMIFILTER_IND: IND FERRITE BEAD CHIP 120E 3A 0603; Part Reference: FL92; Automotive Alternate_mfr_part_number: MPZ1608S121ATDH5; Automotive Alternate_mfr_name: TDK; Direct Alternate_mfr_part_number: MPZ1608S121ATAH0; Part_type: INDUCTOR; Mfr_part_number: BLM18KG121TH1D; Mfr_name: MURATA; Mistral Part No: 130018100051-R; Custom_Duty: 24%; Customs_HS_Code: 85437099; Wattage: NA; Tolerance: 25%; Project: TI_J7ES_EVM_SOM; Value: 120E; PCB Footprint: EMIFIL_BLM18P_0603_0-8; Direct Alternate_mfr_name: TDK; Footprint Path: Y:\MIS_DATABASE\Library\ALTIUM_TOOL\PCB_FOOTPRINTS\Altium_Footprint_Lib.PcbLib; Library Path: Y:\MIS_DATABASE\Library\ALTIUM_TOOL\SCHEMATICS_PARTS\MS_FILTER_Library.schlib; MECHANICAL 3D STEP FILE: EMIFIL_BLM18P_0603_0-8; Chkd/date: MANIRAJA/251018; Crtd /date: ALVY/251018; Datasheet: Y:\MIS_DATABASE\DATASHEETS\DISCRETES\INDUCTORS\BLM18XX-H1D-SER.PDF; Temperature: -55°C+125°C; Weight: 4mg; Height: 0.75MM; Library Ref: EMIFILTER_IND; Distributor_part_number: 490-13261-1-ND; Distributor_name: DIGIKEY; Package: 0603; Voltage: NA; Footprint Ref: EMIFIL_BLM18P_0603_0-8
R111 = RESISTOR_Dup2: RES 4.7K 1/20W 5% 0201; Part Reference: R111; Mistral Part No: 110010070061-R; Mfr_name: PANASONIC-ECG; Mfr_part_number: ERJ-1GNJ472C; Part_type: RESISTORS\FIXED; Project: CUSTOM DCA1000; Voltage: NA; Customs_HS_Code: 85332119; Custom_Duty: 15%; Value: 4.7K; PCB Footprint: RES0201_0-5; Footprint Path: Y:\MIS_DATABASE\Library\ALTIUM_TOOL\PCB_FOOTPRINTS\Altium_Footprint_Lib.PcbLib; Library Path: Y:\MIS_DATABASE\Library\ALTIUM_TOOL\SCHEMATICS_PARTS\MS_DISCRETE_Library.schlib; MECHANICAL 3D STEP FILE: RES0201_0-5; Footprint Ref: RES0201_0-5; Tolerance: 5%; Wattage: 1/20W; Package: 0201; Distributor_name: DIGIKEY; Distributor_part_number: P4.7AECT-ND; Library Ref: RESISTOR; Height: 0.26MM; Weight: 0.15mg; Temperature: -55°C+125°C; Datasheet: Y:\MIS_DATABASE\DATASHEETS\RESISTORS\PAN-ERJSER_NOV17.PDF; Crtd /date: ALVY/170420; Chkd/date: MANIRAJA/170420
R123 = RESISTOR_Dup2: RES 4.7K 1/20W 5% 0201; Part Reference: R123; Part_type: RESISTORS\FIXED; Mfr_part_number: ERJ-1GNJ472C; Mfr_name: PANASONIC-ECG; Mistral Part No: 110010070061-R; Custom_Duty: 15%; Customs_HS_Code: 85332119; Voltage: NA; Project: CUSTOM DCA1000; Value: 4.7K; PCB Footprint: RES0201_0-5; Footprint Path: Y:\MIS_DATABASE\Library\ALTIUM_TOOL\PCB_FOOTPRINTS\Altium_Footprint_Lib.PcbLib; Library Path: Y:\MIS_DATABASE\Library\ALTIUM_TOOL\SCHEMATICS_PARTS\MS_DISCRETE_Library.schlib; MECHANICAL 3D STEP FILE: RES0201_0-5; Footprint Ref: RES0201_0-5; Chkd/date: MANIRAJA/170420; Crtd /date: ALVY/170420; Datasheet: Y:\MIS_DATABASE\DATASHEETS\RESISTORS\PAN-ERJSER_NOV17.PDF; Temperature: -55°C+125°C; Weight: 0.15mg; Height: 0.26MM; Library Ref: RESISTOR; Distributor_part_number: P4.7AECT-ND; Distributor_name: DIGIKEY; Package: 0201; Wattage: 1/20W; Tolerance: 5%
R125 = RESISTOR_Dup2: RES 4.7K 1/20W 5% 0201; Part Reference: R125; Part_type: RESISTORS\FIXED; Mfr_part_number: ERJ-1GNJ472C; Mfr_name: PANASONIC-ECG; Mistral Part No: 110010070061-R; Custom_Duty: 15%; Customs_HS_Code: 85332119; Voltage: NA; Project: CUSTOM DCA1000; Value: 4.7K; PCB Footprint: RES0201_0-5; Footprint Path: Y:\MIS_DATABASE\Library\ALTIUM_TOOL\PCB_FOOTPRINTS\Altium_Footprint_Lib.PcbLib; Library Path: Y:\MIS_DATABASE\Library\ALTIUM_TOOL\SCHEMATICS_PARTS\MS_DISCRETE_Library.schlib; MECHANICAL 3D STEP FILE: RES0201_0-5; Footprint Ref: RES0201_0-5; Chkd/date: MANIRAJA/170420; Crtd /date: ALVY/170420; Datasheet: Y:\MIS_DATABASE\DATASHEETS\RESISTORS\PAN-ERJSER_NOV17.PDF; Temperature: -55°C+125°C; Weight: 0.15mg; Height: 0.26MM; Library Ref: RESISTOR; Distributor_part_number: P4.7AECT-ND; Distributor_name: DIGIKEY; Package: 0201; Wattage: 1/20W; Tolerance: 5%
R127 = RESISTOR_Dup2: RES 4.7K 1/20W 5% 0201; Part Reference: R127; Mistral Part No: 110010070061-R; Mfr_name: PANASONIC-ECG; Mfr_part_number: ERJ-1GNJ472C; Part_type: RESISTORS\FIXED; Project: CUSTOM DCA1000; Voltage: NA; Customs_HS_Code: 85332119; Custom_Duty: 15%; Value: 4.7K; PCB Footprint: RES0201_0-5; Tolerance: 5%; Wattage: 1/20W; Package: 0201; Distributor_name: DIGIKEY; Distributor_part_number: P4.7AECT-ND; Library Ref: RESISTOR; Height: 0.26MM; Weight: 0.15mg; Temperature: -55°C+125°C; Datasheet: Y:\MIS_DATABASE\DATASHEETS\RESISTORS\PAN-ERJSER_NOV17.PDF; Crtd /date: ALVY/170420; Chkd/date: MANIRAJA/170420; Footprint Ref: RES0201_0-5; MECHANICAL 3D STEP FILE: RES0201_0-5; Library Path: Y:\MIS_DATABASE\Library\ALTIUM_TOOL\SCHEMATICS_PARTS\MS_DISCRETE_Library.schlib; Footprint Path: Y:\MIS_DATABASE\Library\ALTIUM_TOOL\PCB_FOOTPRINTS\Altium_Footprint_Lib.PcbLib
R129 = RESISTOR_Dup2: RES 9.53K 1/10W 1% 0402; Part Reference: R129; Part_type: RESISTORS\FIXED; Mfr_part_number: ERJ-2RKF9531X; Mfr_name: PANASONIC-ECG; Mistral Part No: 110010110003-R; Custom_Duty: 15%; Customs_HS_Code: 85332119; Voltage: NA; Project: CPCI3GADC_CARD; Value: 9.53K_1%; PCB Footprint: RES0402_0-5; Footprint Path: Y:\MIS_DATABASE\Library\ALTIUM_TOOL\PCB_FOOTPRINTS\Altium_Footprint_Lib.PcbLib; Library Path: Y:\MIS_DATABASE\Library\ALTIUM_TOOL\SCHEMATICS_PARTS\MS_DISCRETE_Library.schlib; MECHANICAL 3D STEP FILE: RES0402_0-5; Chkd/date: MAZHAR/101110; Crtd /date: BAVISH/091110; Datasheet: Y:\MIS_DATABASE\DATASHEETS\RESISTORS\PAN-ERJSER_NOV17.PDF; Temperature: -55°C+155°C; Weight: 0.8mg; Height: 0.40MM; Library Ref: RESISTOR; Distributor_part_number: P9.53KLCT-ND; Distributor_name: DIGIKEY; Package: 0402; Wattage: 1/10W; Tolerance: 1%; Footprint Ref: RES0402_0-5
R132 = RESISTOR_Dup2: RES 1M 1/10W 1% 0402; Part Reference: R132; Part_type: RESISTORS\FIXED; Mfr_part_number: ERJ-2RKF1004X; Mfr_name: PANASONIC-ECG; Mistral Part No: 110010020012-R; Custom_Duty: 15%; Customs_HS_Code: 85332119; Voltage: NA; Project: KOPIN_MODULS; Value: 1M_1%; PCB Footprint: RES0402_0-5; Footprint Path: Y:\MIS_DATABASE\Library\ALTIUM_TOOL\PCB_FOOTPRINTS\Altium_Footprint_Lib.PcbLib; Library Path: Y:\MIS_DATABASE\Library\ALTIUM_TOOL\SCHEMATICS_PARTS\MS_DISCRETE_Library.schlib; MECHANICAL 3D STEP FILE: RES0402_0-5; Chkd/date: VASANTHA/291216; Crtd /date: MAZHAR/110210; Datasheet: Y:\MIS_DATABASE\DATASHEETS\RESISTORS\PAN-ERJSER_NOV17.PDF; Temperature: -55°C+155°C; Weight: 0.8mg; Height: 0.40MM; Library Ref: RESISTOR; Distributor_part_number: P1.00MLCT-ND; Distributor_name: DIGIKEY; Package: 0402; Wattage: 1/10W; Tolerance: 1%; Footprint Ref: RES0402_0-5
R133 = RESISTOR_Dup2: RES 4.7K 1/20W 5% 0201; Part Reference: R133; Mistral Part No: 110010070061-R; Mfr_name: PANASONIC-ECG; Mfr_part_number: ERJ-1GNJ472C; Part_type: RESISTORS\FIXED; Project: CUSTOM DCA1000; Voltage: NA; Customs_HS_Code: 85332119; Custom_Duty: 15%; Value: 4.7K; PCB Footprint: RES0201_0-5; Footprint Path: Y:\MIS_DATABASE\Library\ALTIUM_TOOL\PCB_FOOTPRINTS\Altium_Footprint_Lib.PcbLib; Library Path: Y:\MIS_DATABASE\Library\ALTIUM_TOOL\SCHEMATICS_PARTS\MS_DISCRETE_Library.schlib; MECHANICAL 3D STEP FILE: RES0201_0-5; Footprint Ref: RES0201_0-5; Tolerance: 5%; Wattage: 1/20W; Package: 0201; Distributor_name: DIGIKEY; Distributor_part_number: P4.7AECT-ND; Library Ref: RESISTOR; Height: 0.26MM; Weight: 0.15mg; Temperature: -55°C+125°C; Datasheet: Y:\MIS_DATABASE\DATASHEETS\RESISTORS\PAN-ERJSER_NOV17.PDF; Crtd /date: ALVY/170420; Chkd/date: MANIRAJA/170420
R362 = RESISTOR_Dup2: RES 4.7K 1/20W 5% 0201; Part Reference: R362; Part_type: RESISTORS\FIXED; Mfr_part_number: ERJ-1GNJ472C; Mfr_name: PANASONIC-ECG; Mistral Part No: 110010070061-R; Custom_Duty: 15%; Customs_HS_Code: 85332119; Voltage: NA; Project: CUSTOM DCA1000; Value: 4.7K; PCB Footprint: RES0201_0-5; Chkd/date: MANIRAJA/170420; Crtd /date: ALVY/170420; Datasheet: Y:\MIS_DATABASE\DATASHEETS\RESISTORS\PAN-ERJSER_NOV17.PDF; Temperature: -55°C+125°C; Weight: 0.15mg; Height: 0.26MM; Library Ref: RESISTOR; Distributor_part_number: P4.7AECT-ND; Distributor_name: DIGIKEY; Package: 0201; Wattage: 1/20W; Tolerance: 5%; Footprint Ref: RES0201_0-5; MECHANICAL 3D STEP FILE: RES0201_0-5; Library Path: Y:\MIS_DATABASE\Library\ALTIUM_TOOL\SCHEMATICS_PARTS\MS_DISCRETE_Library.schlib; Footprint Path: Y:\MIS_DATABASE\Library\ALTIUM_TOOL\PCB_FOOTPRINTS\Altium_Footprint_Lib.PcbLib
R365 = RESISTOR_Dup2: RES 4.7K 1/20W 5% 0201; Part Reference: R365; Part_type: RESISTORS\FIXED; Mfr_part_number: ERJ-1GNJ472C; Mfr_name: PANASONIC-ECG; Mistral Part No: 110010070061-R; Custom_Duty: 15%; Customs_HS_Code: 85332119; Voltage: NA; Project: CUSTOM DCA1000; Value: 4.7K; PCB Footprint: RES0201_0-5; Chkd/date: MANIRAJA/170420; Crtd /date: ALVY/170420; Datasheet: Y:\MIS_DATABASE\DATASHEETS\RESISTORS\PAN-ERJSER_NOV17.PDF; Temperature: -55°C+125°C; Weight: 0.15mg; Height: 0.26MM; Library Ref: RESISTOR; Distributor_part_number: P4.7AECT-ND; Distributor_name: DIGIKEY; Package: 0201; Wattage: 1/20W; Tolerance: 5%; Footprint Ref: RES0201_0-5; MECHANICAL 3D STEP FILE: RES0201_0-5; Library Path: Y:\MIS_DATABASE\Library\ALTIUM_TOOL\SCHEMATICS_PARTS\MS_DISCRETE_Library.schlib; Footprint Path: Y:\MIS_DATABASE\Library\ALTIUM_TOOL\PCB_FOOTPRINTS\Altium_Footprint_Lib.PcbLib
R367 = RESISTOR_Dup2: RES 4.7K 1/20W 5% 0201; Part Reference: R367; Mistral Part No: 110010070061-R; Mfr_name: PANASONIC-ECG; Mfr_part_number: ERJ-1GNJ472C; Part_type: RESISTORS\FIXED; Project: CUSTOM DCA1000; Voltage: NA; Customs_HS_Code: 85332119; Custom_Duty: 15%; Value: 4.7K; PCB Footprint: RES0201_0-5; Footprint Path: Y:\MIS_DATABASE\Library\ALTIUM_TOOL\PCB_FOOTPRINTS\Altium_Footprint_Lib.PcbLib; Library Path: Y:\MIS_DATABASE\Library\ALTIUM_TOOL\SCHEMATICS_PARTS\MS_DISCRETE_Library.schlib; MECHANICAL 3D STEP FILE: RES0201_0-5; Footprint Ref: RES0201_0-5; Tolerance: 5%; Wattage: 1/20W; Package: 0201; Distributor_name: DIGIKEY; Distributor_part_number: P4.7AECT-ND; Library Ref: RESISTOR; Height: 0.26MM; Weight: 0.15mg; Temperature: -55°C+125°C; Datasheet: Y:\MIS_DATABASE\DATASHEETS\RESISTORS\PAN-ERJSER_NOV17.PDF; Crtd /date: ALVY/170420; Chkd/date: MANIRAJA/170420
R430 = RESISTOR_Dup2: RES 20K 1/10W 5% 0402; Part Reference: R430; Mistral Part No: 110009030481-R; Mfr_name: PANASONIC-ECG; Mfr_part_number: ERJ-2GEJ203X; Part_type: RESISTORS\FIXED; Project: G4SLIM; Voltage: NA; Customs_HS_Code: 85332119; Custom_Duty: 15%; Value: 20K; PCB Footprint: RES0402_0-5; Footprint Ref: RES0402_0-5; Tolerance: 5%; Wattage: 1/10W; Package: 0402; Distributor_name: DIGIKEY; Distributor_part_number: P20KJCT-ND; Library Ref: RESISTOR; Height: 0.40MM; Weight: 0.8mg; Temperature: -55°C+155°C; Datasheet: Y:\MIS_DATABASE\DATASHEETS\RESISTORS\PAN-ERJSER_NOV17.PDF; Crtd /date: MAZHAR/140505; Chkd/date: SHREESHAIL/121205; MECHANICAL 3D STEP FILE: RES0402_0-5; Library Path: Y:\MIS_DATABASE\Library\ALTIUM_TOOL\SCHEMATICS_PARTS\MS_DISCRETE_Library.schlib; Footprint Path: Y:\MIS_DATABASE\Library\ALTIUM_TOOL\PCB_FOOTPRINTS\Altium_Footprint_Lib.PcbLib
R431 = RESISTOR_Dup2: RES 10K 1/16W 5% 0402; Part Reference: R431; Mistral Part No: 110011060021-R; Mfr_name: YAGEO AMERICA; Mfr_part_number: RC0402JR-0710KL; Part_type: RESISTORS\FIXED; Project: HSE; Voltage: NA; Customs_HS_Code: 85332119; Custom_Duty: 15%; Value: 10K; PCB Footprint: RES0402_0-5; Footprint Path: Y:\MIS_DATABASE\Library\ALTIUM_TOOL\PCB_FOOTPRINTS\Altium_Footprint_Lib.PcbLib; Library Path: Y:\MIS_DATABASE\Library\ALTIUM_TOOL\SCHEMATICS_PARTS\MS_DISCRETE_Library.schlib; Footprint Ref: RES0402_0-5; Library Ref: RESISTOR; Tolerance: 5%; Wattage: 1/16W; Package: 0402; Distributor_name: DIGIKEY; Distributor_part_number: 311-10KJRCT-ND; Height: 0.40MM; Weight: 0.65mg; Temperature: -55°C+155°C; Datasheet: Y:\MIS_DATABASE\DATASHEETS\RESISTORS\RCXXXXL-SER_MAR18.PDF; Crtd /date: MAZHAR/230805; Chkd/date: VASANTHA/061216; MECHANICAL 3D STEP FILE: RES0402_0-5
U20 = TUSB8041_VQFN64: IC 4-PORT USB 3.0 HUB VQFN64; Part Reference: U20; Part_type: ICS\INTERFACE; Mfr_name: TEXAS INSTRUMENTS; Mistral Part No: 141021020005-R; Custom_Duty: 15%; Customs_HS_Code: 85423100; Wattage: NA; Project: J7ES_SK_BRD; Value: TUSB8041RGCR; PCB Footprint: QFN64_19-68_360X360_1_EP6-1; Footprint Path: Y:\MIS_DATABASE\Library\ALTIUM_TOOL\PCB_FOOTPRINTS\Altium_Footprint_Lib.PcbLib; Library Path: Y:\MIS_DATABASE\Library\ALTIUM_TOOL\SCHEMATICS_PARTS\MS_MISCINTERFACE_Library.schlib; MECHANICAL 3D STEP FILE: QFN64_19-68_360X360_1_EP6-1; Chkd/date: MANIRAJA/030221; Crtd /date: ALVY/010221; Datasheet: Y:\MIS_DATABASE\DATASHEETS\ICS\INTERFACE\TUSB8041.PDF; Temperature: 0°C+70°C; Weight: 227.4mg; Height: 1.00MM; Library Ref: TUSB8041_VQFN64; Distributor_part_number: 296-41028-1-ND; Distributor_name: DIGIKEY; Package: VQFN64; Voltage: NA; Tolerance: NA; Mfr_part_number: TUSB8041RGCR; Footprint Ref: QFN64_19-68_360X360_1_EP6-1
Y1 = CRY4_13: CRY 24.000MHz 18pF SMD; Part Reference: Y1; Mistral Part No: 130021010004-R; Mfr_name: WURTH ELEKTRONIK; Part_type: CRYSTAL; Project: TI_DRA829 SK EVM BRD; Tolerance: NA; Customs_HS_Code: 85439000; Custom_Duty: 24%; Value: 24.000MHz; PCB Footprint: XTAL4_LFXTAL055474_130X110_SMD_0-8; Footprint Ref: XTAL4_LFXTAL055474_130X110_SMD_0-8; Voltage: NA; Wattage: NA; Package: SMD; Distributor_name: NA; Distributor_part_number: NA; Library Ref: CRY4_13; Height: 0.80MM; Weight: NA; Temperature: -40°C+85°C; Datasheet: Y:\MIS_DATABASE\DATASHEETS\MISC\CRY_OSC\830058124.PDF; Crtd /date: ALVY/311220; Chkd/date: MANIRAJA/040121; MECHANICAL 3D STEP FILE: XTAL4_LFXTAL055474_130X110_SMD_0-8; Library Path: Y:\MIS_DATABASE\Library\ALTIUM_TOOL\SCHEMATICS_PARTS\MS_DISCRETE_Library.schlib; Footprint Path: Y:\MIS_DATABASE\Library\ALTIUM_TOOL\PCB_FOOTPRINTS\Altium_Footprint_Lib.PcbLib